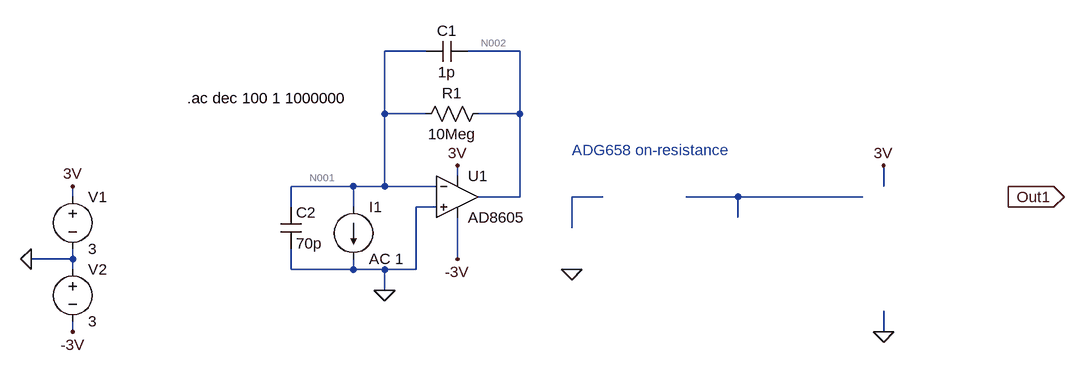
[diagram p0: schematic pay-optical-first-stage.asc]
pay-optical-first-stage.asc, the LTspice schematic file:
Version 4
SHEET 1 1160 680
WIRE 176 -80 112 -80
WIRE 320 -80 240 -80
WIRE 112 16 112 -80
WIRE 176 16 112 16
WIRE 320 16 320 -80
WIRE 320 16 256 16
WIRE 224 112 224 96
WIRE 64 128 -32 128
WIRE 112 128 112 16
WIRE 112 128 64 128
WIRE 192 128 112 128
WIRE 880 128 880 96
WIRE -368 144 -368 128
WIRE 320 144 320 16
WIRE 320 144 256 144
WIRE 448 144 400 144
WIRE 656 144 576 144
WIRE 848 144 656 144
WIRE -32 160 -32 128
WIRE 64 160 64 128
WIRE 192 160 160 160
WIRE 656 176 656 144
WIRE 400 192 400 144
WIRE -368 240 -368 224
WIRE -368 240 -432 240
WIRE 224 240 224 176
WIRE -368 256 -368 240
WIRE -32 256 -32 224
WIRE 64 256 64 240
WIRE 64 256 -32 256
WIRE 112 256 64 256
WIRE 160 256 160 160
WIRE 160 256 112 256
WIRE 112 288 112 256
WIRE -368 352 -368 336
WIRE 880 352 880 320
FLAG 112 288 0
FLAG 1072 144 Out1
IOPIN 1072 144 Out
FLAG -368 128 3V
FLAG 224 96 3V
FLAG 880 96 3V
FLAG 880 352 0
FLAG 400 256 0
FLAG -368 352 -3V
FLAG 224 240 -3V
FLAG -432 240 0
SYMBOL voltage -368 128 R0
WINDOW 123 0 0 Left 0
WINDOW 39 0 0 Left 0
SYMATTR InstName V1
SYMATTR Value 3
SYMBOL res 272 0 R90
WINDOW 0 0 56 VBottom 2
WINDOW 3 32 56 VTop 2
SYMATTR InstName R1
SYMATTR Value 10Meg
SYMBOL cap 240 -96 R90
WINDOW 0 0 32 VBottom 2
WINDOW 3 32 32 VTop 2
SYMATTR InstName C1
SYMATTR Value 1p
SYMBOL cap -48 160 R0
SYMATTR InstName C2
SYMATTR Value 70p
SYMBOL current 64 160 R0
WINDOW 123 0 0 Left 0
WINDOW 39 0 0 Left 0
SYMATTR InstName I1
SYMATTR Value AC 1
SYMBOL Opamps\\AD8605 224 80 R0
SYMATTR InstName U1
SYMBOL voltage -368 240 R0
WINDOW 123 0 0 Left 0
WINDOW 39 0 0 Left 0
SYMATTR InstName V2
SYMATTR Value 3
TEXT -192 -8 Left 2 !.ac dec 100 1 1000000
TEXT 400 72 Left 2 ;ADG658 on-resistance

The netlist it stands for:
* pay-optical-first-stage.asc
V1 3V 0 3
R1 N002 N001 10Meg
C1 N002 N001 1p
C2 N001 0 70p
I1 N001 0 AC 1
XU1 0 N001 3V -3V N002 AD8605  ; pins In+ In- V+ V- OUT
V2 0 -3V 3
.ac dec 100 1 1000000
* ADG658 on-resistance
.lib ADI.lib
.backanno
.end

* Results of the author's LTspice run, read from the files saved beside the schematic
* Operating Point, zero values left out:
*   V(3v) = 3 V
*   V(n002) = -97.2 µV
*   V(n001) = -96.7 µV
*   V(-3v) = -3 V
*   I(V2) = -591.3 µA
*   I(V1) = -591.3 µA
*   Ix(u1:99) = 591.3 µA
*   Ix(u1:50) = -591.3 µA
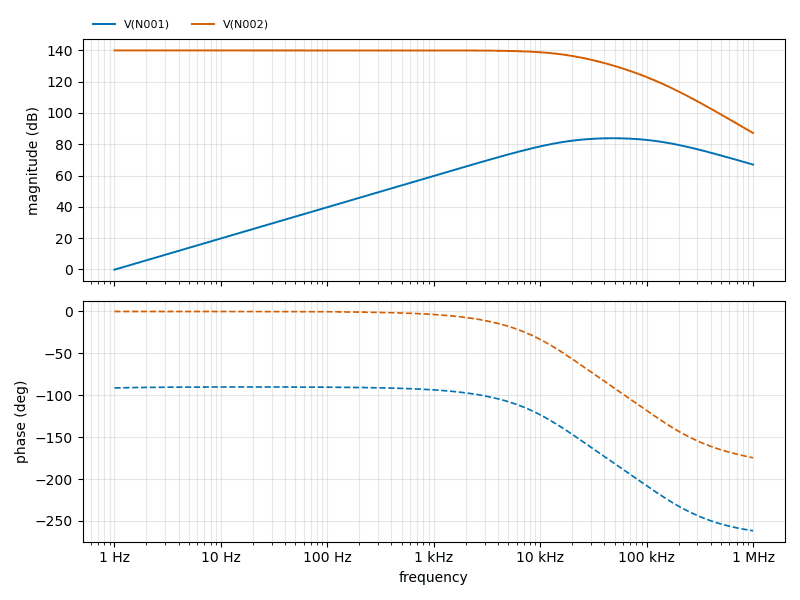
[diagram p1: AC Analysis of pay-optical-first-stage.asc, plotted from the saved traces]
* AC Analysis, 1 run:
*   V(N001): -0.18 dB at 1 Hz, 67.00 dB at 1 MHz, peak 83.85 dB at 47.86 kHz, 3 dB below the peak at 14.46 kHz and 159.4 kHz
*   V(N002): 140.00 dB at 1 Hz, 87.18 dB at 1 MHz, peak 140.00 dB at 1 Hz, 3 dB below the peak at 17.83 kHz